# Altium schematic sheet I2C_BUS_MUX.SchDoc
size Letter
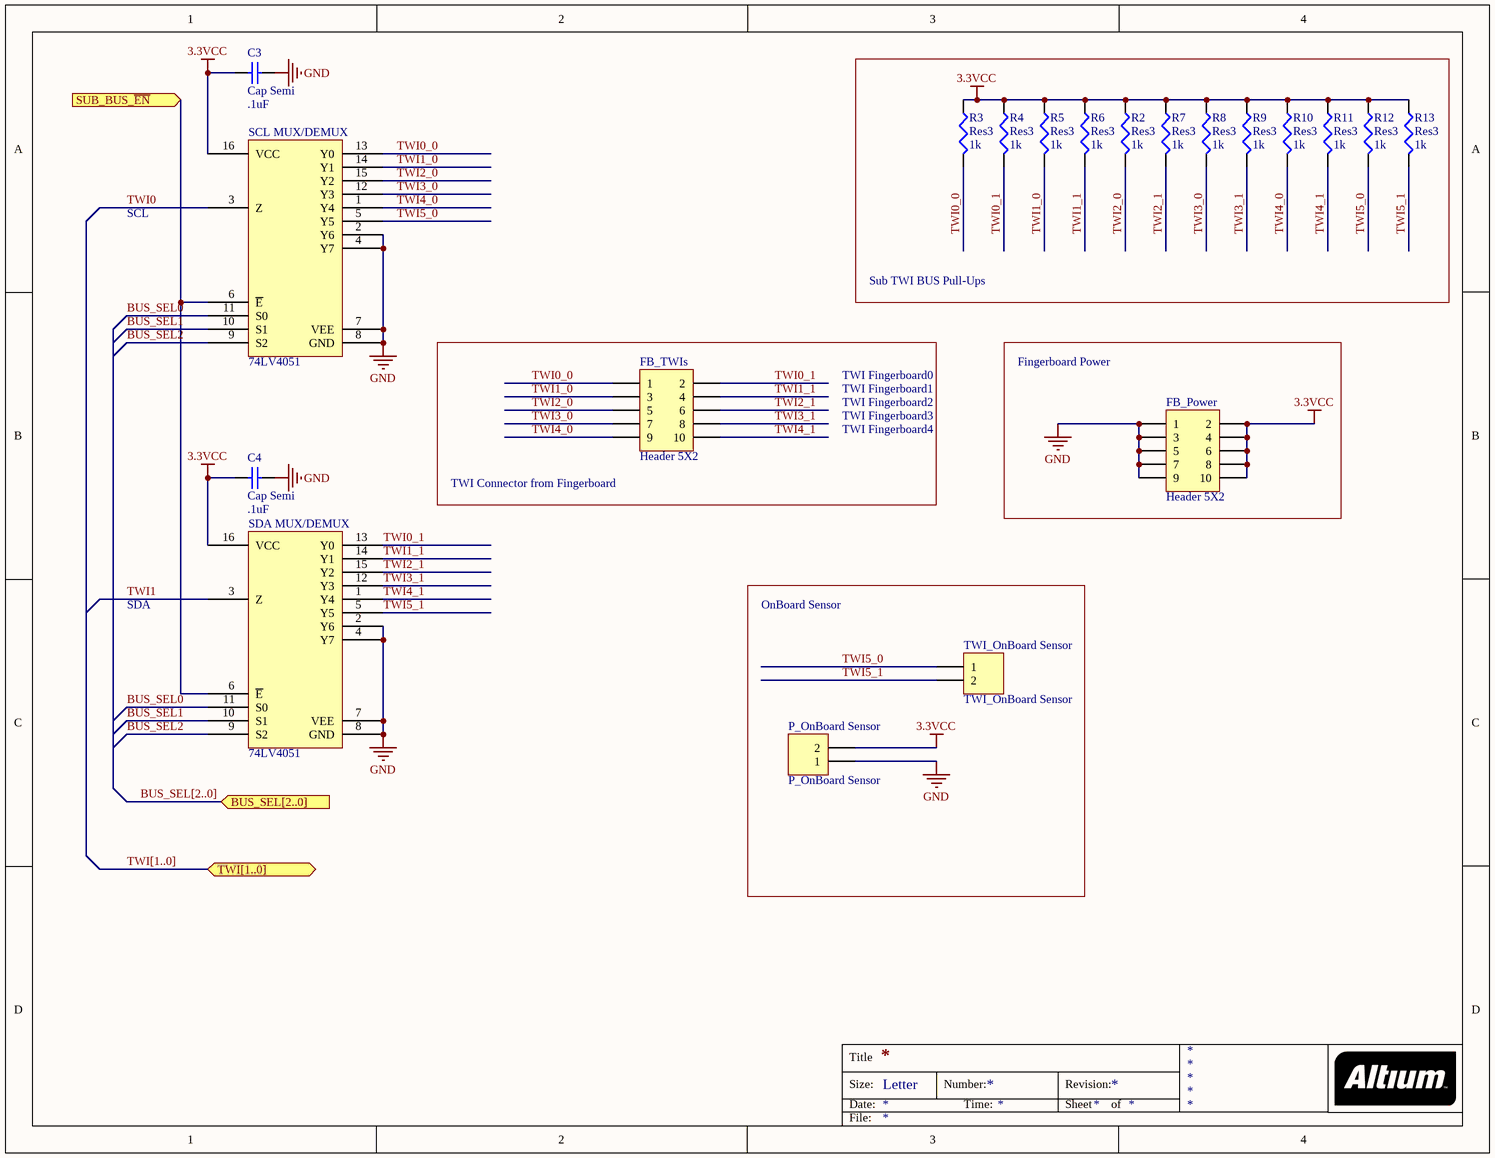
[diagram p0: I2C_BUS_MUX.SchDoc]

## Parts
C3  Cap Semi  value .1uF  [CAPC2012N]
C4  Cap Semi  value .1uF  [CAPC2012N]
FB_Power  Header 5X2  [HDR2X5]
FB_TWIs  Header 5X2  [HDR2X5]
P_OnBoard_Sensor  P_OnBoard Sensor  [HDR1X2]
R2  Res3  value 1k  [RESC2012N]
R3  Res3  value 1k  [RESC2012N]
R4  Res3  value 1k  [RESC2012N]
R5  Res3  value 1k  [RESC2012N]
R6  Res3  value 1k  [RESC2012N]
R7  Res3  value 1k  [RESC2012N]
R8  Res3  value 1k  [RESC2012N]
R9  Res3  value 1k  [RESC2012N]
R10  Res3  value 1k  [RESC2012N]
R11  Res3  value 1k  [RESC2012N]
R12  Res3  value 1k  [RESC2012N]
R13  Res3  value 1k  [RESC2012N]
SCL_MUX/DEMUX  74LV4051  [SOIC127P600-16N]
SDA_MUX/DEMUX  74LV4051  [SOIC127P600-16N]
TWI_OnBoard_Sensor  TWI_OnBoard Sensor  [HDR1X2]

## Blocks framed on the sheet
Sub TWI BUS Pull-Ups: R2-R13
Fingerboard Power: FB_Power
OnBoard Sensor: P_OnBoard_Sensor TWI_OnBoard_Sensor

## Ports
BUS_SEL[2..0] (in), SUB_BUS_~{EN} (in), TWI[1..0] (bidir)

## Nets
3.3VCC: C3.2 C4.2 FB_Power.2 FB_Power.4 FB_Power.6 FB_Power.8 FB_Power.10 P_OnBoard_Sensor.2 R2.1 R3.1 R4.1 R5.1 R6.1 R7.1 R8.1 R9.1 R10.1 R11.1 R12.1 R13.1 SCL_MUX/DEMUX.16(VCC) SDA_MUX/DEMUX.16(VCC)
GND: C3.1 C4.1 FB_Power.1 FB_Power.3 FB_Power.5 FB_Power.7 FB_Power.9 P_OnBoard_Sensor.1 SCL_MUX/DEMUX.2(Y6) SCL_MUX/DEMUX.4(Y7) SCL_MUX/DEMUX.7(VEE) SCL_MUX/DEMUX.8(GND) SDA_MUX/DEMUX.2(Y6) SDA_MUX/DEMUX.4(Y7) SDA_MUX/DEMUX.7(VEE) SDA_MUX/DEMUX.8(GND)
BUS_SEL0: SCL_MUX/DEMUX.11(S0) SDA_MUX/DEMUX.11(S0)
BUS_SEL1: SCL_MUX/DEMUX.10(S1) SDA_MUX/DEMUX.10(S1)
BUS_SEL2: SCL_MUX/DEMUX.9(S2) SDA_MUX/DEMUX.9(S2)
SUB_BUS_~{EN}: SCL_MUX/DEMUX.6(~{E}) SDA_MUX/DEMUX.6(~{E}) ; port SUB_BUS_~{EN}
TWI0: SCL_MUX/DEMUX.3(Z)
TWI0_0: FB_TWIs.1 R3.2 SCL_MUX/DEMUX.13(Y0)
TWI0_1: FB_TWIs.2 R4.2 SDA_MUX/DEMUX.13(Y0)
TWI1: SDA_MUX/DEMUX.3(Z)
TWI1_0: FB_TWIs.3 R5.2 SCL_MUX/DEMUX.14(Y1)
TWI1_1: FB_TWIs.4 R6.2 SDA_MUX/DEMUX.14(Y1)
TWI2_0: FB_TWIs.5 R2.2 SCL_MUX/DEMUX.15(Y2)
TWI2_1: FB_TWIs.6 R7.2 SDA_MUX/DEMUX.15(Y2)
TWI3_0: FB_TWIs.7 R8.2 SCL_MUX/DEMUX.12(Y3)
TWI3_1: FB_TWIs.8 R9.2 SDA_MUX/DEMUX.12(Y3)
TWI4_0: FB_TWIs.9 R10.2 SCL_MUX/DEMUX.1(Y4)
TWI4_1: FB_TWIs.10 R11.2 SDA_MUX/DEMUX.1(Y4)
TWI5_0: R12.2 SCL_MUX/DEMUX.5(Y5) TWI_OnBoard_Sensor.1
TWI5_1: R13.2 SDA_MUX/DEMUX.5(Y5) TWI_OnBoard_Sensor.2

## Buses and harness runs
bus BUS_SEL[2..0] = port BUS_SEL[2..0]
bus TWI[1..0] = port TWI[1..0]

## Notes on the sheet
- SCL
- TWI Fingerboard0
- TWI Fingerboard1
- TWI Fingerboard2
- TWI Fingerboard3
- TWI Fingerboard4
- (near FB_TWIs) TWI Connector from Fingerboard
- SDA
- Title
- Size:
- Date:
- Letter
- Number:
- Time:
- Revision:
- Sheet
- of
- File:

## Library data of the parts
C3 C4 = Cap Semi: Capacitor (Semiconductor SIM Model); Published: 8-Jun-2000; LatestRevisionDate: 29-May-2009; LatestRevisionNote: IPC-7351 Footprint Added.; PackageReference: C1206; Publisher: Altium Limited; PackageDescription: Chip Capacitor
FB_Power FB_TWIs = Header 5X2: Header, 5-Pin, Dual row; LatestRevisionDate: 17-Jul-2002; LatestRevisionNote: Re-released for DXP Platform.; Publisher: Altium Limited
P_OnBoard_Sensor TWI_OnBoard_Sensor = Header 2: Header, 2-Pin; LatestRevisionDate: 17-Jul-2002; LatestRevisionNote: Re-released for DXP Platform.; Publisher: Altium Limited
R2-R13 = Res3: Resistor; Published: 8-Jun-2000; LatestRevisionDate: 29-May-2009; LatestRevisionNote: IPC-7351 Footprint Added.; PackageReference: J1-0603; Publisher: Altium Limited; PackageDescription: Chip Resistor